# EAGLE schematic HBridge (EAGLE 9.6.2)
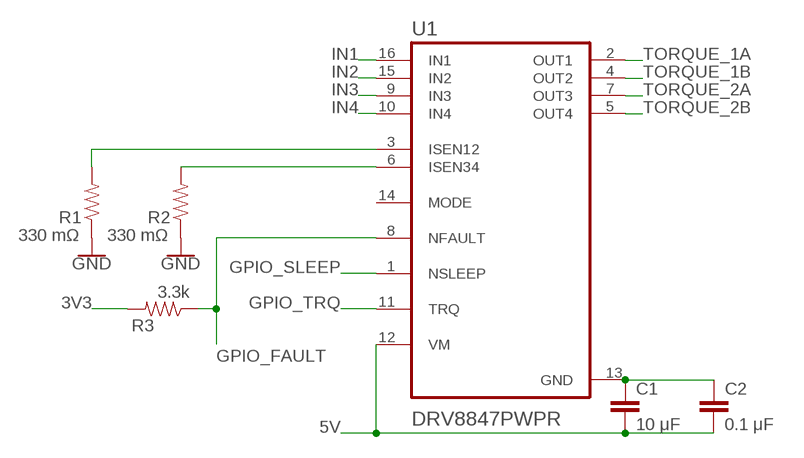
[diagram p0: schematic, sheet 1]

## Parts
C1  10 μF  CAP0805  [0805]
C2  0.1 μF  CAP0805  [0805]
R1  330 mΩ  RESISTOR0805-RES  [0805]
R2  330 mΩ  RESISTOR0805-RES  [0805]
R3  3.3k  RESISTOR0805-RES  [0805]
U1  DRV8847PWPR  [SOP65P640X120-17N]

## Nets
3V3: R3.2
5V: C1.2 C2.2 U1.12(VM)
GND: R1.1 R2.1
GPIO_FAULT: R3.1 U1.8(NFAULT)
GPIO_SLEEP: U1.1(NSLEEP)
GPIO_TRQ: U1.11(TRQ)
IN1: U1.16(IN1)
IN2: U1.15(IN2)
IN3: U1.9(IN3)
IN4: U1.10(IN4)
N$1: R1.2 U1.3(ISEN12)
N$2: R2.2 U1.6(ISEN34)
N$3: C1.1 C2.1 U1.13(GND)
TORQUE_1A: U1.2(OUT1)
TORQUE_1B: U1.4(OUT2)
TORQUE_2A: U1.7(OUT3)
TORQUE_2B: U1.5(OUT4)
Unconnected: U1.14(MODE)

## Library data of the parts
C1 C2 = HSFL_Main_Library:CAP: Capacitor Standard 0603 ceramic capacitor, and 0.1" leaded capacitor.
R1-R3 = HSFL_Main_Library:RESISTOR: Resistor Basic schematic elements and footprints for 0603, 1206, and PTH resistors.
U1 = DRV8847PWPR:DRV8847PWPR: None Check prices <https://pricing.snapeda.com/parts/DRV8847PWPR/Texas%20Instruments/view-part?ref=eda>; AVAILABILITY: Warning; DESCRIPTION: 18-V, 2-A dual H-bridge motor driver with current regulation & independent half-bridge control 16-HTSSOP -40 to 125; MF: Texas Instruments; MP: DRV8847PWPR; PACKAGE: HTSSOP-16 Texas Instruments; PRICE: None; PURCHASE-URL: https://pricing.snapeda.com/search/part/DRV8847PWPR/?ref=eda